# Altium schematic sheet MCU.SchDoc
size A4
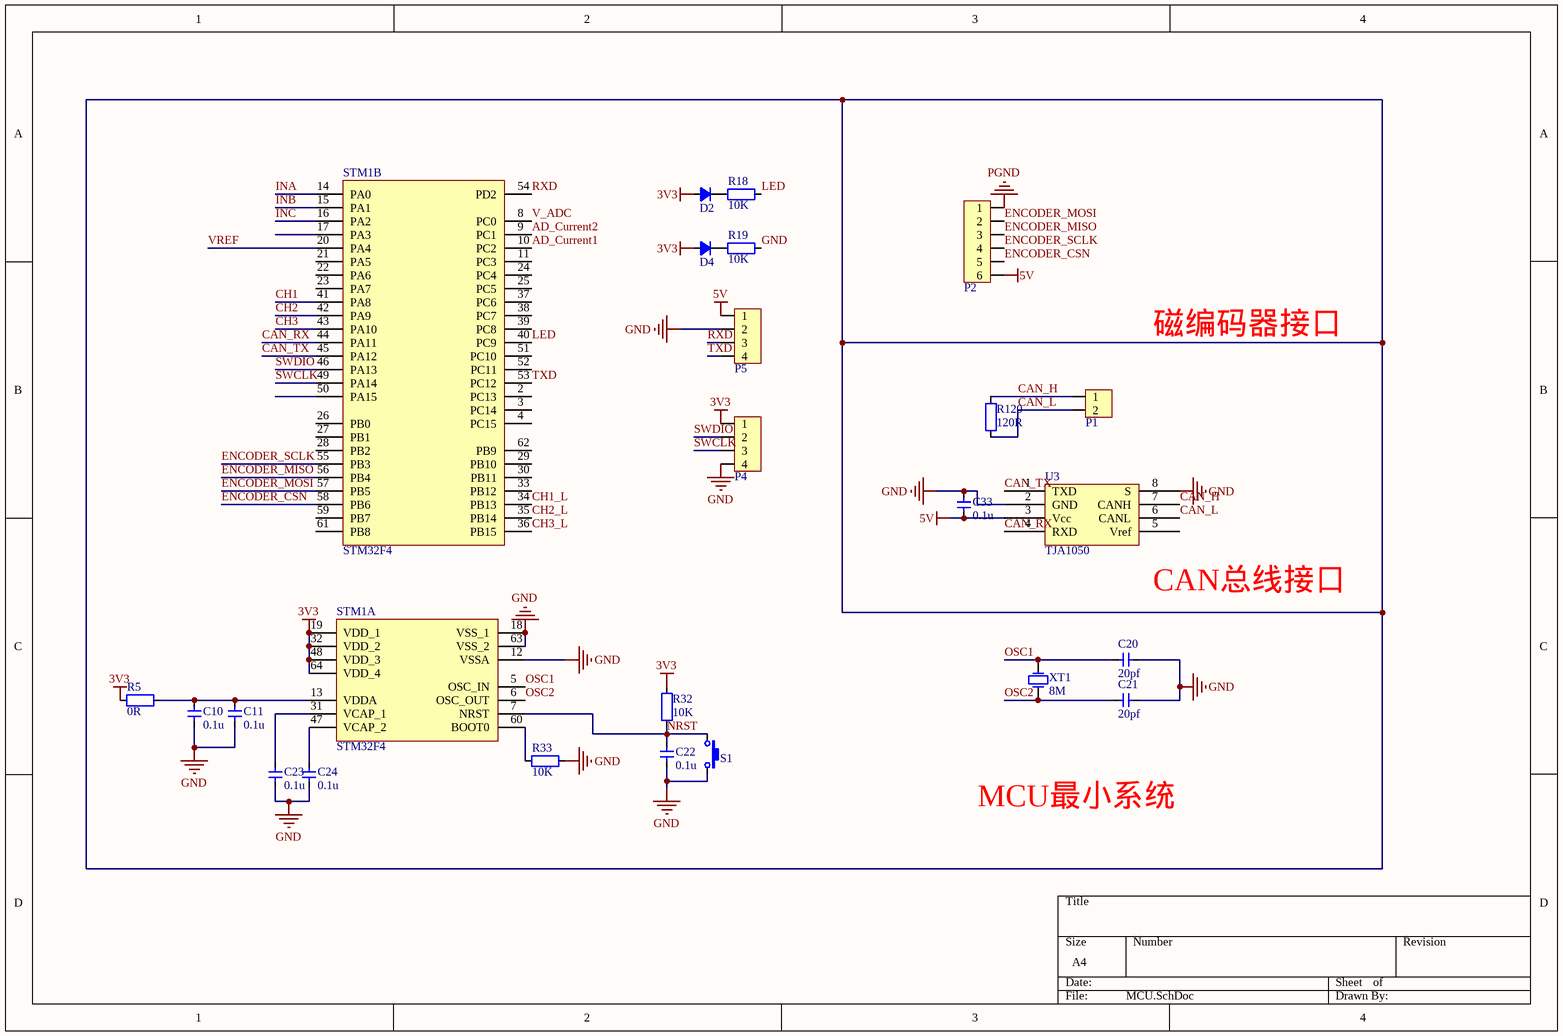
[diagram p0: MCU.SchDoc]

## Parts
C10  value 0.1u  [CAP_0603]  (hidden comment: Cap_0603)
C11  value 0.1u  [CAP_0603]  (hidden comment: Cap_0603)
C20  value 20pf  [CAP_0603]  (hidden comment: Cap_0603)
C21  value 20pf  [CAP_0603]  (hidden comment: Cap_0603)
C22  value 0.1u  [CAP_0603]  (hidden comment: Cap_0603)
C23  value 0.1u  [CAP_0603]  (hidden comment: Cap_0603)
C24  value 0.1u  [CAP_0603]  (hidden comment: Cap_0603)
C33  value 0.1u  [CAP_0603]  (hidden comment: Cap_0603)
D2  D_0805  [LED_0805_YELLOW]  (value not drawn)
D4  D_0805  [LED_0805_YELLOW]  (value not drawn)
P1  HDR1x2_2.54  [HDR1X2_2.54_180]  (value not drawn)
P2  HDR1x6_2.54  [1.25mm_1X6_SMT]  (value not drawn)
P4  HDR1x4_2.54  [HDR1X4_2.54_90]  (value not drawn)
P5  HDR1x4_2.54  [1.25X4_SMT]  (value not drawn)
R5  value 0R  [RES_0603]  (hidden comment: Res_0603)
R18  value 10K  [RES_0603]  (hidden comment: Res_0603)
R19  value 10K  [RES_0603]  (hidden comment: Res_0603)
R32  value 10K  [RES_0603]  (hidden comment: Res_0603)
R33  value 10K  [RES_0603]  (hidden comment: Res_0603)
R120  value 120R  [RES_0603]  (hidden comment: Res_0603)
S1  ButtonTACT_3x4x2_180  [ButtonTACT_3x4x2_180H]  (value not drawn)
STM1  STM32F4  [LQFP_P0.5_64]  (parts A,B of 2)
U3  TJA1050  [SOP_E150_8]
XT1  value 8M  [XT_5032_2]  (hidden comment: XTAL_5032_2P)

## Nets
3V3: D2.1(A) D4.1(A) P4.1 R5.1 R32.1 STM1.19(VDD_1) STM1.32(VDD_2) STM1.48(VDD_3) STM1.64(VDD_4)
5V: C33.1 P2.6 P5.1 U3.3(Vcc)
GND: C10.1 C11.1 C20.1 C21.1 C22.1 C23.2 C24.2 C33.2 P4.4 P5.2 R19.2 R33.2 S1.2 STM1.12(VSSA) STM1.18(VSS_1) STM1.63(VSS_2) U3.2(GND) U3.8(S)
PGND: P2.1
AD_Current1: STM1.10(PC2)
AD_Current2: STM1.9(PC1)
CAN_H: P1.1 R120.1 U3.7(CANH)
CAN_L: P1.2 R120.2 U3.6(CANL)
CAN_RX: STM1.44(PA11) U3.4(RXD)
CAN_TX: STM1.45(PA12) U3.1(TXD)
CH1: STM1.41(PA8)
CH1_L: STM1.34(PB13)
CH2: STM1.42(PA9)
CH2_L: STM1.35(PB14)
CH3: STM1.43(PA10)
CH3_L: STM1.36(PB15)
ENCODER_CSN: P2.5 STM1.58(PB6)
ENCODER_MISO: P2.3 STM1.56(PB4)
ENCODER_MOSI: P2.2 STM1.57(PB5)
ENCODER_SCLK: P2.4 STM1.55(PB3)
INA: STM1.14(PA0)
INB: STM1.15(PA1)
INC: STM1.16(PA2)
LED: R18.2 STM1.40(PC9)
NRST: C22.2 R32.2 S1.1 STM1.7(NRST)
OSC1: C20.2 STM1.5(OSC_IN) XT1.2(OSC2)
OSC2: C21.2 STM1.6(OSC_OUT) XT1.1(OSC1)
RXD: P5.3 STM1.54(PD2)
SWCLK: P4.3 STM1.49(PA14)
SWDIO: P4.2 STM1.46(PA13)
TXD: P5.4 STM1.53(PC12)
V_ADC: STM1.8(PC0)
VREF: STM1.20(PA4)
NetC10_2: C10.2 C11.2 R5.2 STM1.13(VDDA)
NetC23_1: C23.1 STM1.31(VCAP_1)
NetC24_1: C24.1 STM1.47(VCAP_2)
NetD2_2: D2.2(K) R18.1
NetD4_2: D4.2(K) R19.1
NetR33_1: R33.1 STM1.60(BOOT0)

Not connected (* = marked no-connect by the designer): STM1 2(PC13) 3(PC14) 4(PC15) 11(PC3) 17(PA3) 21(PA5) 22(PA6) 23(PA7) 24(PC4) 25(PC5) 26(PB0) 27(PB1) 28(PB2) 29(PB10) 30(PB11) 33(PB12) 37(PC6) 38(PC7) 39(PC8) 50(PA15) 51(PC10) 52(PC11) 59(PB7) 61(PB8) 62(PB9); U3 5(Vref)

## Notes on the sheet
- 磁编码器接口
- (near U3) CAN总线接口
- MCU最小系统

## Library data of the parts
C10 C11 C20-C24 C33 = Cap_0603: Capacitor
P1 = HDR1x2_2.54: Header
P2 = HDR1x6_2.54T: Header
P4 P5 = HDR1x4_2.54: Header
R5 R18 R19 R32 R33 R120 = Res_0603: Resistor
S1 = ButtonTACT_3x4x2_180: Button
STM1 = STM32F405R: MCU
XT1 = XTAL_5032_2P: Crystal Oscillator